# EAGLE schematic firstTestUno (EAGLE 9.1.3)
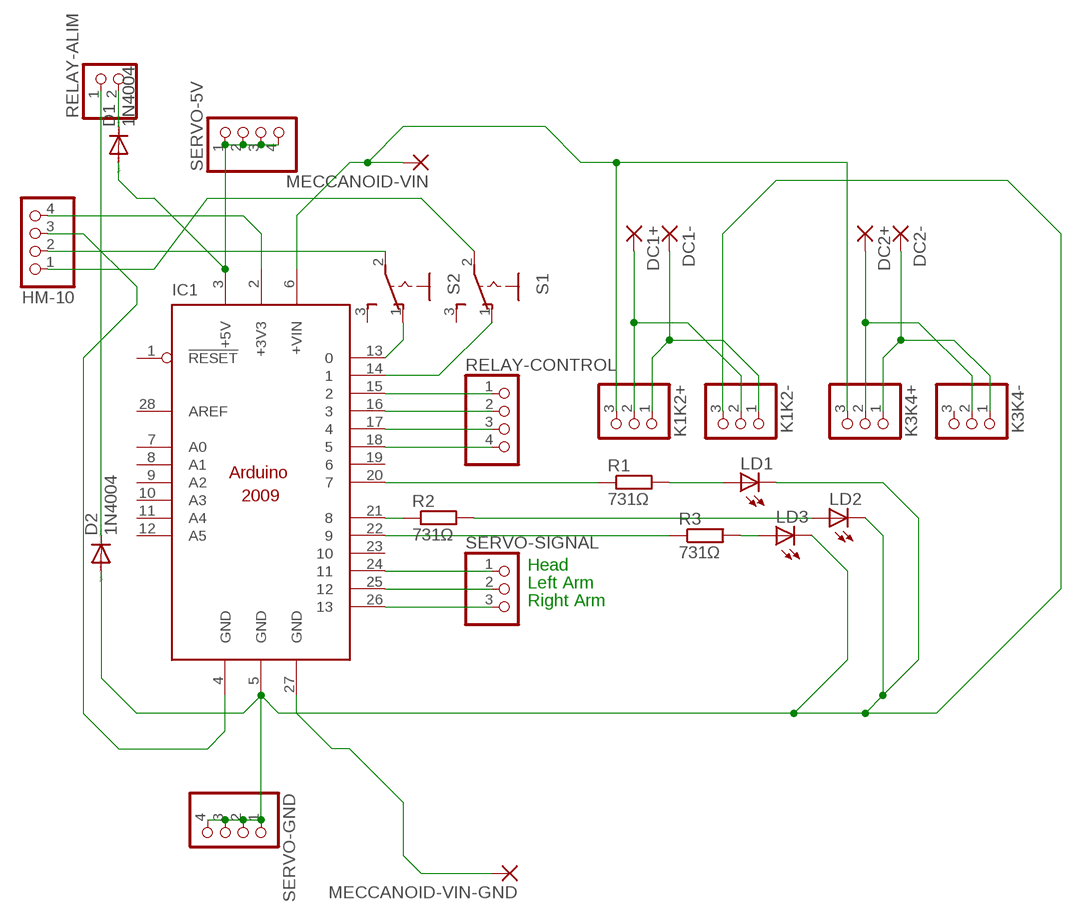
[diagram p0: schematic, sheet 1]

## Parts
D1  1N4004  [DO41-10]
D2  1N4004  [DO41-10]
DC1+  1,6/0,8  [1,6/0,8]
DC1-  1,6/0,8  [1,6/0,8]
DC2+  1,6/0,8  [1,6/0,8]
DC2-  1,6/0,8  [1,6/0,8]
HM-10  PINHD-1X4  [1X04]
IC1  ARDUINO2009_10  [ARDUINO2009]
K1K2+  PINHD-1X3/90  [1X03/90]
K1K2-  PINHD-1X3/90  [1X03/90]
K3K4+  PINHD-1X3/90  [1X03/90]
K3K4-  PINHD-1X3/90  [1X03/90]
LD1  LED3MM  [LED3MM]
LD2  LED3MM  [LED3MM]
LD3  LED3MM  [LED3MM]
MECCANOID-VIN  1,6/0,8  [1,6/0,8]
MECCANOID-VIN-GND  1,6/0,8  [1,6/0,8]
R1  731Ω  R-EU_0207/5V  [0207/5V]
R2  731Ω  R-EU_0207/5V  [0207/5V]
R3  731Ω  R-EU_0207/5V  [0207/5V]
RELAY-ALIM  PINHD-1X2  [1X02]
RELAY-CONTROL  PINHD-1X4  [1X04]
S1  255SB  [255SB]
S2  255SB  [255SB]
SERVO-5V  PINHD-1X4  [1X04]
SERVO-GND  PINHD-1X4  [1X04]
SERVO-SIGNAL  PINHD-1X3  [1X03]

## Nets
N$1: HM-10.3 IC1.4(GND)
N$2: HM-10.4 IC1.2(+3V3)
N$3: IC1.13 S2.1(O)
N$4: D1.A IC1.3(+5V) SERVO-5V.1 SERVO-5V.2 SERVO-5V.3 SERVO-5V.4
N$5: HM-10.2 S2.2(P)
N$6: D1.C RELAY-ALIM.2
N$7: IC1.27(GND) MECCANOID-VIN-GND.1(P)
N$9: IC1.26 SERVO-SIGNAL.3
N$10: IC1.25 SERVO-SIGNAL.2
N$11: IC1.24 SERVO-SIGNAL.1
N$12: IC1.15 RELAY-CONTROL.1
N$13: IC1.16 RELAY-CONTROL.2
N$14: IC1.17 RELAY-CONTROL.3
N$15: IC1.18 RELAY-CONTROL.4
N$16: D2.C RELAY-ALIM.1
N$17: IC1.20 R1.1
N$18: DC1+.1(P) K1K2+.2 K1K2-.2
N$19: IC1.14 S1.1(O)
N$20: HM-10.1 S1.2(P)
N$21: LD1.A R1.2
N$23: DC1-.1(P) K1K2+.1 K1K2-.1
N$24: LD2.A R2.2
N$25: LD3.A R3.2
N$26: IC1.22 R3.1
N$27: IC1.21 R2.1
N$28: DC2+.1(P) K3K4+.2 K3K4-.2
N$29: DC2-.1(P) K3K4+.1 K3K4-.1
N$30: IC1.6(+VIN) K1K2+.3 K3K4+.3 MECCANOID-VIN.1(P)
N$31: D2.A IC1.5(GND) K1K2-.3 LD1.K(C) LD2.K(C) LD3.K(C) SERVO-GND.1 SERVO-GND.2 SERVO-GND.3 SERVO-GND.4
Unconnected: IC1.1(!RESET) IC1.7(A0) IC1.8(A1) IC1.9(A2) IC1.10(A3) IC1.11(A4) IC1.12(A5) IC1.19 IC1.23 IC1.28(AREF) K3K4-.3 S1.3(S) S2.3(S)

## Notes on the sheet
- Head
- Left Arm
- Right Arm

## Library data of the parts
D1 D2 = diode:1N4004: DIODE general purpose rectifier, 1 A; MF: MULTICOMP; MPN: 1N4004+; OC_FARNELL: 2675015
DC1+ DC1- DC2+ DC2- MECCANOID-VIN MECCANOID-VIN-GND = wirepad:1,6/0,8: THROUGH-HOLE PAD; MF: HELLERMANNTYTON; MPN: TK20-1,6/0,8-PVDF-CL; OC_FARNELL: 2070908
HM-10 RELAY-CONTROL SERVO-5V SERVO-GND = pinhead:PINHD-1X4: PIN HEADER; OC_FARNELL: unknown
IC1 = arduino:ARDUINO2009_1: The Arduino Duemilanove ("2009") is a microcontroller board based on the ATmega168 or ATmega328. - 14 digital input/output pins (of which 6 can be used as PWM outputs) - 6 analog inputs, a 16 MHz crystal oscillator - USB connection - power jack - ISP header - reset button It contains everything needed to support the microcontroller; simply connect it to a computer with a USB cable or power it with a AC-to-DC adapter or battery to get started http://arduino.cc/en/Main/ArduinoBoardDuemilanove; OC_FARNELL: unknown
K1K2+ K1K2- K3K4+ K3K4- = pinhead:PINHD-1X3: PIN HEADER; OC_FARNELL: unknown
LD1-LD3 = led:LED: LED OSRAM: - CHIPLED LG R971, LG N971, LY N971, LG Q971, LY Q971, LO R971, LY R971 LH N974, LH R974 LS Q976, LO Q976, LY Q976 LO Q996 - Hyper CHIPLED LW Q18S LB Q993, LB Q99A, LB R99A - SideLED LS A670, LO A670, LY A670, LG A670, LP A670 LB A673, LV A673, LT A673, LW A673 LH A674 LY A675 LS A676, LA A676, LO A676, LY A676, LW A676 LS A679, LY A679, LG A679 - Hyper Micro SIDELED® LS Y876, LA Y876, LO Y876, LY Y876 LT Y87S - SmartLED LW L88C, LW L88S LB L89C, LB L89S, LG L890 LS L89K, LO L89K, LY L89K LS L896, LA L896, LO L896, LY L896 - TOPLED LS T670, LO T670, LY T670, LG T670, LP T670 LSG T670, LSP T670, LSY T670, LOP T670, LYG T670 LG T671, LOG T671, LSG T671 LB T673, LV T673, LT T673, LW T673 LH T674 LS T676, LA T676, LO T676, LY T676, LB T676, LH T676, LSB T676, LW T676 LB T67C, LV T67C, LT T67C, LS T67K, LO T67K, LY T67K, LW E67C LS E67B, LA E67B, LO E67B, LY E67B, LB E67C, LV E67C, LT E67C LW T67C LS T679, LY T679, LG T679 LS T770, LO T770, LY T770, LG T770, LP T770 LB T773, LV T773, LT T773, LW T773 LH T774 LS E675, LA E675, LY E675, LS T675 LS T776, LA T776, LO T776, LY T776, LB T776 LHGB T686 LT T68C, LB T68C - Hyper Mini TOPLED® LB M676 - Mini TOPLED Santana® LG M470 LS M47K, LO M47K, LY M47K Source: http://www.osram.convergy.de/; MF: MULTICOMP; MPN: LED 2F; OC_FARNELL: 9555420
R1-R3 = resistor:R-EU_: RESISTOR, European symbol; MF: WURTH ELEKTRONIK; MPN: 74270035; OC_FARNELL: 2082481
RELAY-ALIM = pinhead:PINHD-1X2: PIN HEADER; MF: EPCOS; MPN: B65659F0001X023; OC_FARNELL: 2673418
S1 S2 = switch:255SB: SLIDING SWITCH Distributor Buerklin, 11G810; MF: ITT CANNON; MPN: CA3106E32-55SB03; OC_FARNELL: 1729529
SERVO-SIGNAL = pinhead:PINHD-1X3: PIN HEADER; MF: TE CONNECTIVITY; MPN: V23234A0001X038-EV-144; OC_FARNELL: 2085455